# EAGLE design MicroBlue-CPU+PSU_1.0_rdob-millable (EAGLE 6.6.0)
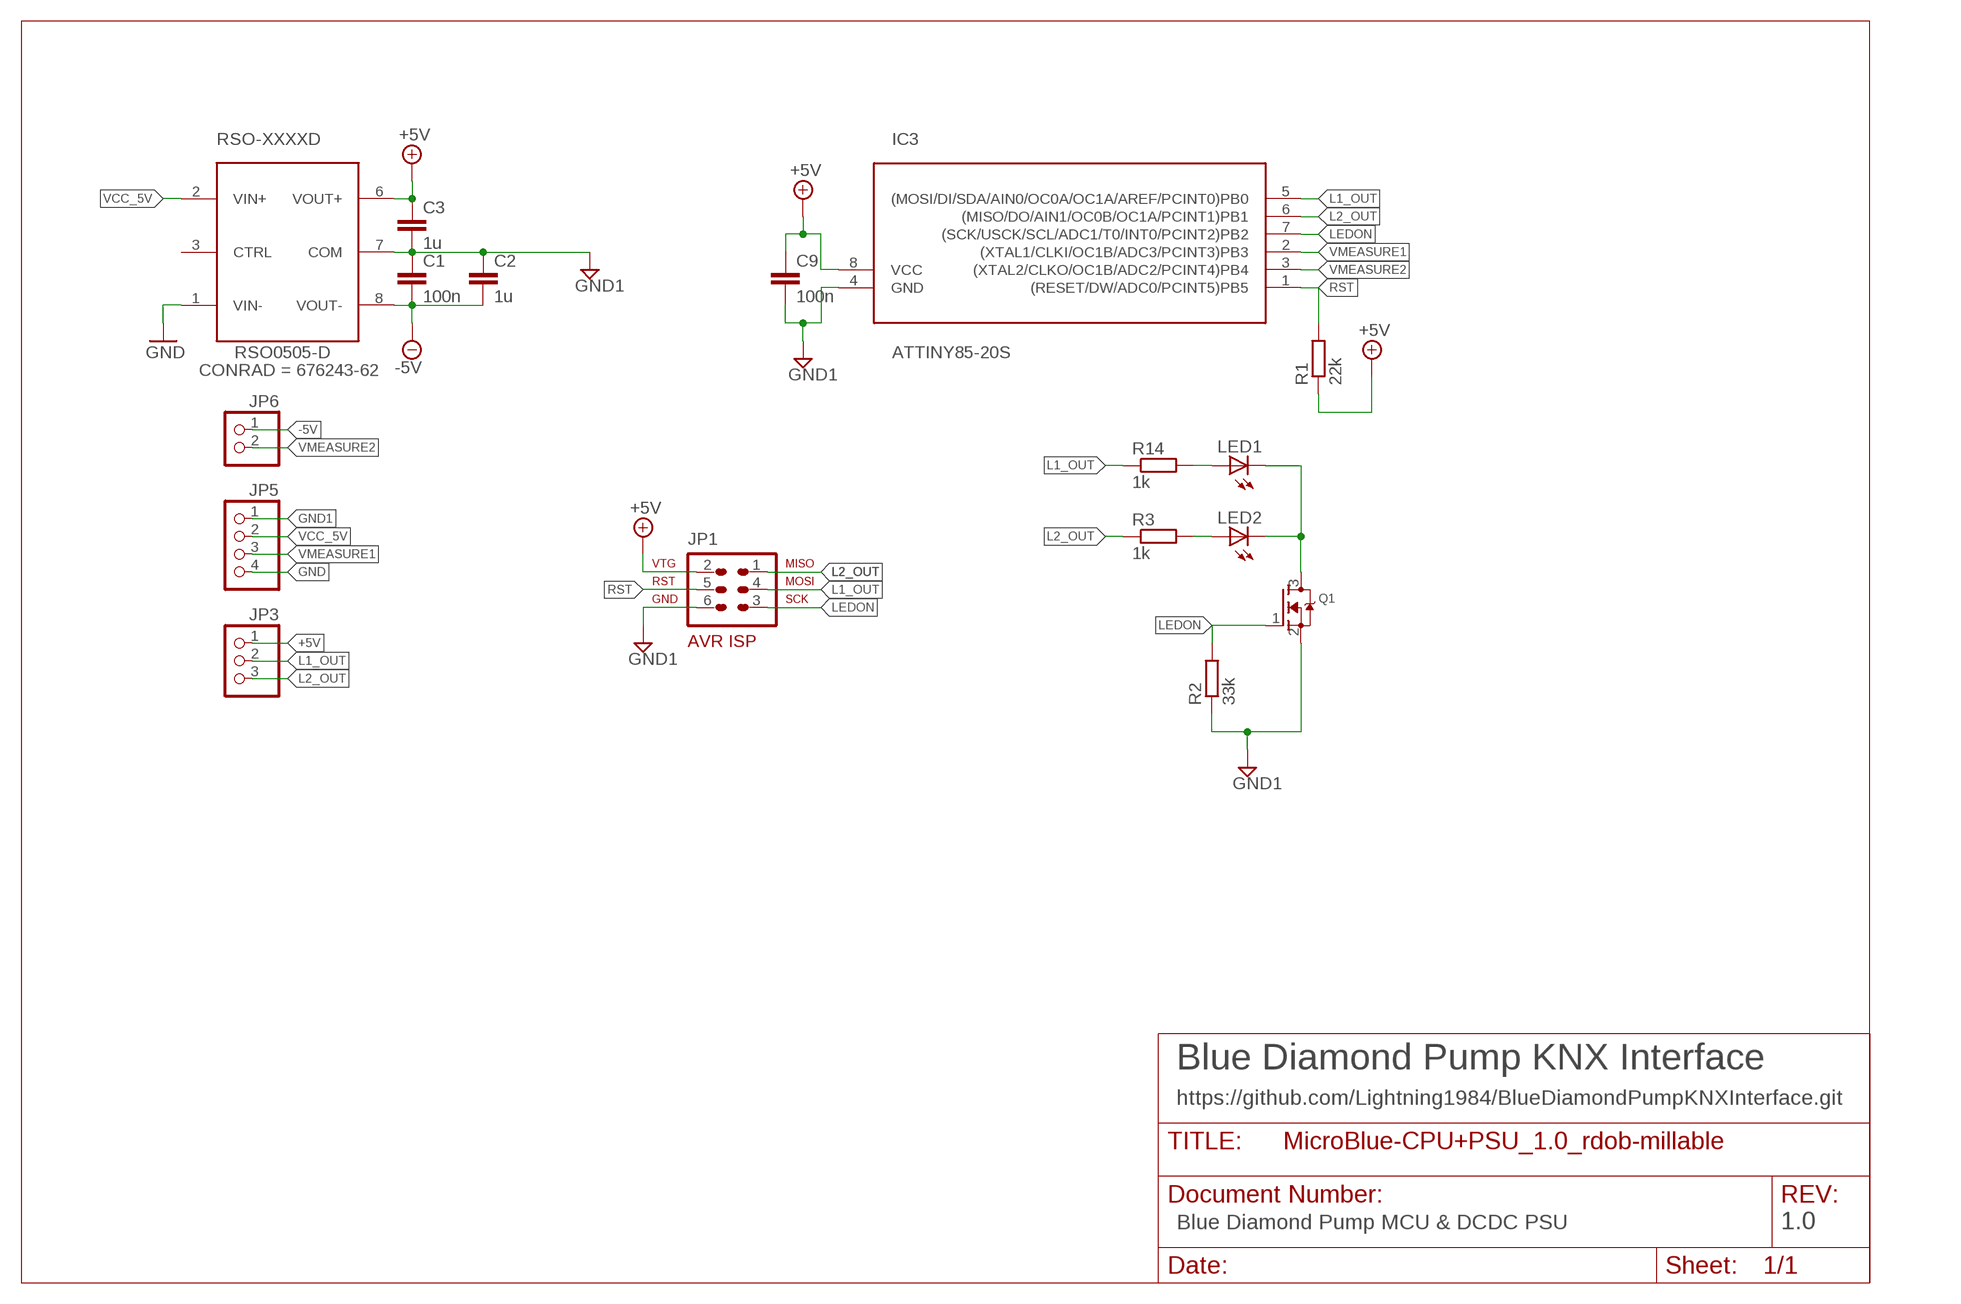
[diagram p0: schematic, sheet 1]

## Parts
C1  100n  C-EUC0805K  [C0805K]
C2  1u  C-EUC0805K  [C0805K]
C3  1u  C-EUC0805K  [C0805K]
C9  100n  C-EUC0805K  [C0805K]
IC3  ATTINY85-20S  [SOIC8]
JP1  AVR-ISP-6R  [AVR-ISP-6R]
JP3  PINHD-1X03_2.54-0.90MM-DRILL  [1X03-0.90DRILL]
JP5  PINHD-1X04_2.54-0.90MM-DRILL  [1X04-0.90DRILL]
JP6  PINHD-1X02_2.54-0.90MM-DRILL  [1X02-0.90DRILL]
LED1  LEDSMT1206  [1206]
LED2  LEDSMT1206  [1206]
Q1  MOSFET-NREFLOW  [SOT23]
R1  22k  R-EU_R1206  [R1206]
R2  33k  R-EU_R1206  [R1206]
R3  1k  R-EU_R1206  [R1206]
R14  1k  R-EU_R1206  [R1206]
RSO0505-D  RSO-0505D  RSO-XXXXD_RSO-XXXXD  [RSO-XXXX]

## Nets
+5V: C3.1 C9.1 IC3.8(VCC) JP1.2 JP3.1 R1.1 RSO0505-D.6(VOUT+)
-5V: C1.2 C2.2 JP6.1 RSO0505-D.8(VOUT-)
GND: JP5.4 RSO0505-D.1(VIN-)
GND1: C1.1 C2.1 C3.2 C9.2 IC3.4(GND) JP1.6 JP5.1 Q1.2(S) R2.1 RSO0505-D.7(COM)
L1_OUT: IC3.5((MOSI/DI/SDA/AIN0/OC0A/OC1A/AREF/PCINT0)PB0) JP1.4 JP3.2 R14.1
L2_OUT: IC3.6((MISO/DO/AIN1/OC0B/OC1A/PCINT1)PB1) JP1.1 JP3.3 R3.1
LEDON: IC3.7((SCK/USCK/SCL/ADC1/T0/INT0/PCINT2)PB2) JP1.3 Q1.1(G) R2.2
N$3: LED2.A R3.2
N$9: LED1.A R14.2
PROG: LED1.C LED2.C Q1.3(D)
RST: IC3.1((RESET/DW/ADC0/PCINT5)PB5) JP1.5 R1.2
VCC_5V: JP5.2 RSO0505-D.2(VIN+)
VMEASURE1 [ANALOG]: IC3.2((XTAL1/CLKI/OC1B/ADC3/PCINT3)PB3) JP5.3
VMEASURE2 [ANALOG]: IC3.3((XTAL2/CLKO/OC1B/ADC2/PCINT4)PB4) JP6.2
Unconnected: RSO0505-D.3(CTRL)

## Notes on the sheet
- Blue Diamond Pump KNX Interface
- https://github.com/Lightning1984/BlueDiamondPumpKNXInterface.git
- Blue Diamond Pump MCU & DCDC PSU | 1.0

## Library data of the parts
C1-C3 C9 = rcl:C-EU: CAPACITOR, European symbol
IC3 = avr:ATTINY85: MICROCONTROLLER 8 Kbytes FLASH 512 bytes EEPROM 512 bytes RAM 4-channel 10 bit ADC USI
JP1 = atmel:AVR-ISP-6: AVR ISP-6 Serial Programming Header
JP3 = pinhead-2:PINHD-1X03: PIN HEADER
JP5 = pinhead-2:PINHD-1X04: PIN HEADER
JP6 = pinhead-2:PINHD-1X02: PIN HEADER
LED1 LED2 = led:LED: LED OSRAM: - CHIPLED LG R971, LG N971, LY N971, LG Q971, LY Q971, LO R971, LY R971 LH N974, LH R974 LS Q976, LO Q976, LY Q976 LO Q996 - Hyper CHIPLED LW Q18S LB Q993, LB Q99A, LB R99A - SideLED LS A670, LO A670, LY A670, LG A670, LP A670 LB A673, LV A673, LT A673, LW A673 LH A674 LY A675 LS A676, LA A676, LO A676, LY A676, LW A676 LS A679, LY A679, LG A679 - Hyper Micro SIDELED® LS Y876, LA Y876, LO Y876, LY Y876 LT Y87S - SmartLED LW L88C, LW L88S LB L89C, LB L89S, LG L890 LS L89K, LO L89K, LY L89K LS L896, LA L896, LO L896, LY L896 - TOPLED LS T670, LO T670, LY T670, LG T670, LP T670 LSG T670, LSP T670, LSY T670, LOP T670, LYG T670 LG T671, LOG T671, LSG T671 LB T673, LV T673, LT T673, LW T673 LH T674 LS T676, LA T676, LO T676, LY T676, LB T676, LH T676, LSB T676, LW T676 LB T67C, LV T67C, LT T67C, LS T67K, LO T67K, LY T67K, LW E67C LS E67B, LA E67B, LO E67B, LY E67B, LB E67C, LV E67C, LT E67C LW T67C LS T679, LY T679, LG T679 LS T770, LO T770, LY T770, LG T770, LP T770 LB T773, LV T773, LT T773, LW T773 LH T774 LS E675, LA E675, LY E675, LS T675 LS T776, LA T776, LO T776, LY T776, LB T776 LHGB T686 LT T68C, LB T68C - Hyper Mini TOPLED® LB M676 - Mini TOPLED Santana® LG M470 LS M47K, LO M47K, LY M47K Source: http://www.osram.convergy.de LUXEON: - LUMILED® LXK2-PW12-R00, LXK2-PW12-S00, LXK2-PW14-U00, LXK2-PW14-V00 LXK2-PM12-R00, LXK2-PM12-S00, LXK2-PM14-U00 LXK2-PE12-Q00, LXK2-PE12-R00, LXK2-PE12-S00, LXK2-PE14-T00, LXK2-PE14-U00 LXK2-PB12-K00, LXK2-PB12-L00, LXK2-PB12-M00, LXK2-PB14-N00, LXK2-PB14-P00, LXK2-PB14-Q00 LXK2-PR12-L00, LXK2-PR12-M00, LXK2-PR14-Q00, LXK2-PR14-R00 LXK2-PD12-Q00, LXK2-PD12-R00, LXK2-PD12-S00 LXK2-PH12-R00, LXK2-PH12-S00 LXK2-PL12-P00, LXK2-PL12-Q00, LXK2-PL12-R00 Source: www.luxeon.com KINGBRIGHT: KA-3528ASYC Source: www.kingbright.com
Q1 = adafruit-2:MOSFET-N: N-Channel Mosfet 2N7002E - 60V 260mA SOT23 [Digikey: 2N7002ET1GOSTR-ND] - REEL BSH103 - 30V 850mA SOT23 [Digikey: 568-5013-1-ND]
R1-R3 R14 = rcl:R-EU_: RESISTOR, European symbol
RSO0505-D = rdob-devices:RSO-XXXXD; CONRAD: 676243-62; DEVICE: RSO0505-D

## Net classes
1 ANALOG: clearance 0.4 mm to class 0, clearance 0.4 mm

## Board
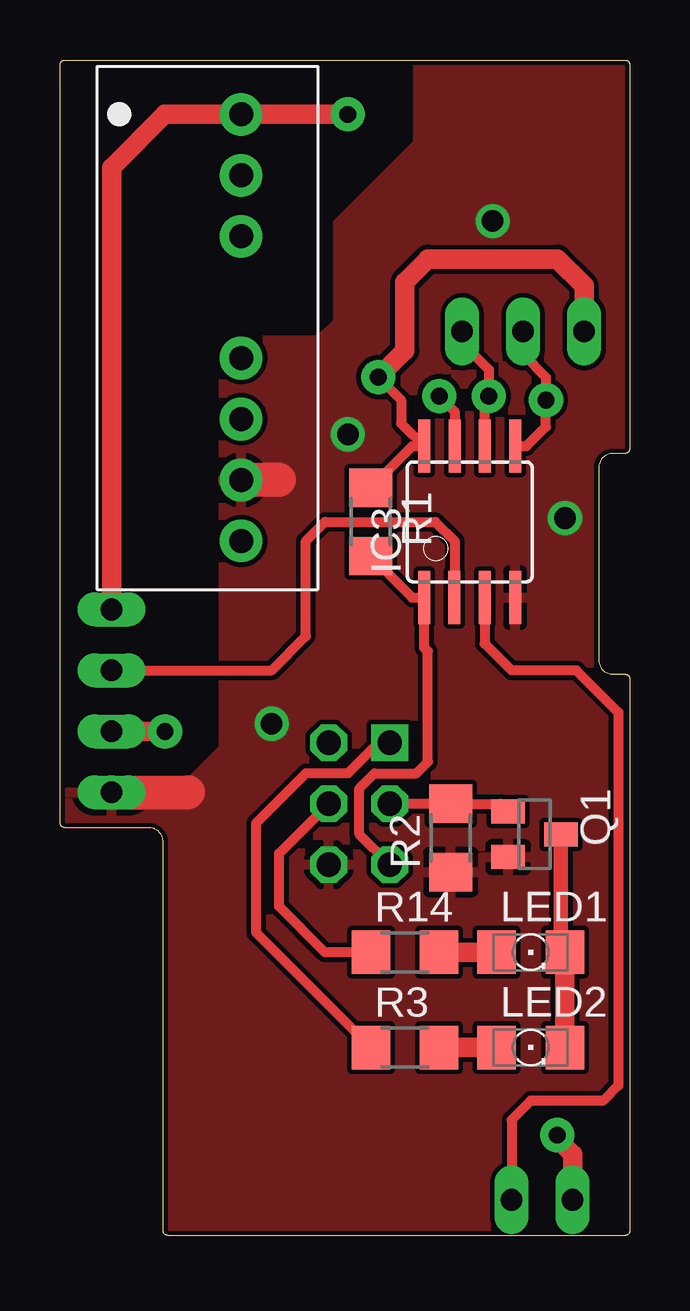
[diagram p1: board, top side]
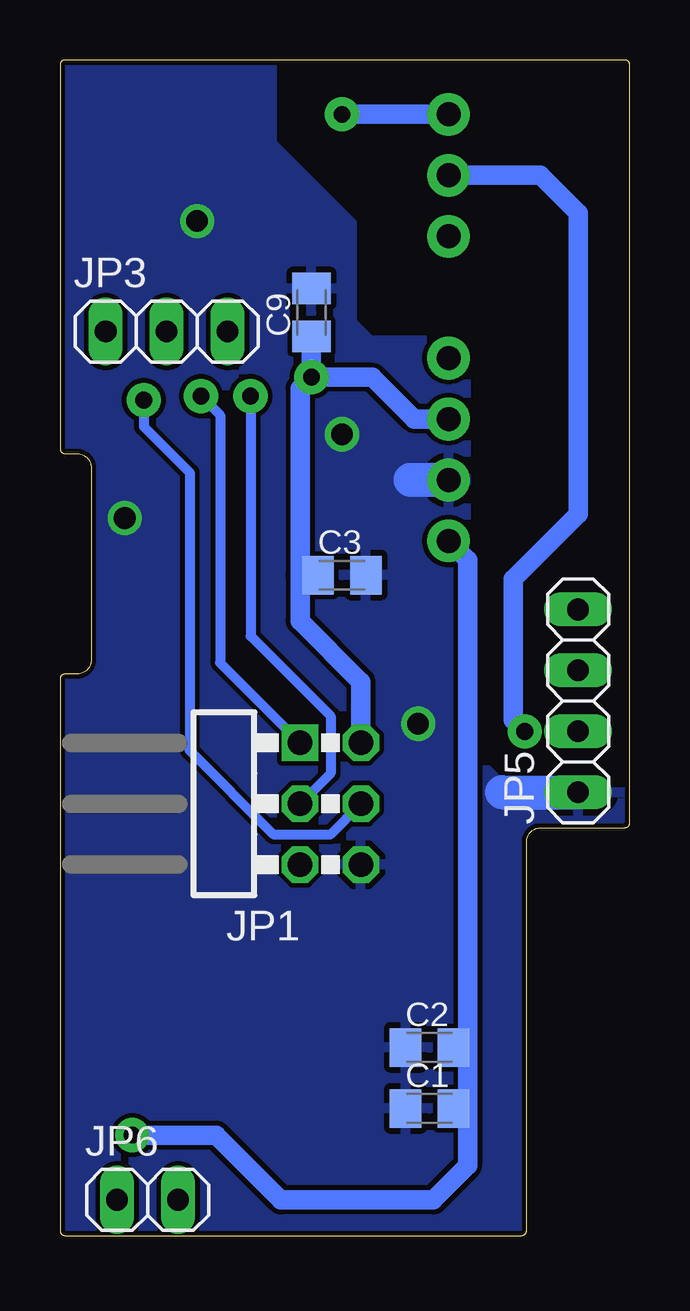
[diagram p2: board, bottom side, seen from below]

Size 23.74 x 49 mm. Coordinates in mm from the lower left corner, seen from the top.
Outline: 3.7,17 0.2,17 arc-90 0,17.2 0,48.8 arc-90 0.2,49 23.54,49 arc-90 23.74,48.8 23.74,32.8 arc-90 23.54,32.6 23.04,32.6 arc90 22.44,32 22.44,24 arc90 23.04,23.4 23.54,23.4 arc-90 23.74,23.2 23.74,0.2 arc-90 23.54,0 4.5,0 arc-90 4.3,0.2 4.3,16.4 arc90 3.7,17
Copper layers (1*16): Top 0.035mm / dielectric 1.5mm / Bottom 0.035mm
Design rules "default *": minimum track width 12mil, minimum drill 24mil, track to track 0.2mm, track to pad 0.2mm, pad to pad 0.2mm, via to via 0.2mm, smd to smd 0.2mm, copper to edge 0.2mm, drill to drill 0.2mm, minimum pad ring 10mil, minimum via ring 8mil, stop-mask expansion 4mil, vias tented up to drill 0mil, thermal gap 10mil
tRestrict: area -0.1,19 to 14.7,49.1
bRestrict: area -0.1,19 to 14.7,49.1

### Footprints (pad centres in the part's own frame; a part is rotated, then mirrored left to right if it is on the bottom)
C0805K = smd 1.3 x 1.6: 1 -1,0; 2 1,0
SOIC8 = smd 0.5 x 2.2: 1 -1.905,-3.154; 2 -0.645,-3.154; 3 0.625,-3.154; 4 1.895,-3.154; 5 1.905,3.154; 6 0.635,3.154; 7 -0.635,3.154; 8 -1.905,3.154
AVR-ISP-6R = drill 1.016 square: 1 -2.54,-1.27 | drill 1.016 octagon: 2 -2.54,1.27; 3 0,-1.27; 4 0,1.27; 5 2.54,-1.27; 6 2.54,1.27
1X03-0.90DRILL = drill 0.9 pad 1.422 long: 1 -2.54,0; 2 0,0; 3 2.54,0
1X04-0.90DRILL = drill 0.9 pad 1.422 long: 1 -3.81,0; 2 -1.27,0; 3 1.27,0; 4 3.81,0
1X02-0.90DRILL = drill 0.9 pad 1.422 long: 1 -1.27,0; 2 1.27,0
1206 = smd 1.6 x 1.803: A -1.422,0; C 1.422,0
SOT23 = smd 1 x 1.4: 1 -0.95,-1.1; 2 0.95,-1.1; 3 0,1.1
R1206 = smd 1.6 x 1.803: 1 -1.422,0; 2 1.422,0
RSO-XXXX = drill 1 pad 1.778: 1 -7.62,0; 2 -5.08,0; 3 -2.54,0; 5 2.54,0; 6 5.08,0; 7 7.62,0; 8 10.16,0

### Placement (x,y rotation side)
C1  8.34,5.3 0 bottom
C2  8.34,7.84 0 bottom
C3  11.99,27.52 0 bottom
C9  13.26,38.48 90 bottom
IC3  17.07,29.75 0 top
JP1  12.47,18 270 bottom
JP3  19.3,37.68 0 bottom
JP5  2.15,22.29 90 bottom
JP6  20.09,1.49 0 bottom
LED1  19.61,11.81 0 top
LED2  19.61,7.84 0 top
Q1  19.77,16.73 270 top
R1  12.95,29.75 270 top
R2  16.28,16.57 90 top
R3  14.37,7.84 0 top
R14  14.37,11.81 0 top
RSO0505-D  7.55,39.11 270 top

### Tracks (layer width: path | path; a pad name or v marks a point on that pad's centre or on a via)
+5V  (via drill 0.7 pad 1.42)
  Top 0.406: R1.1 14.68,32.9 IC3.8 14.21,33.85 14.21,34.83 v13.26,35.78
  Top 0.813: v13.26,35.78 14.37,36.89 14.37,39.75 15.33,40.7 20.72,40.7 21.84,39.59 JP3.1
  Bottom 0.813: JP1.2 11.2,23.08 13.74,25.62 13.74,27.52 | C9.1 v13.26,35.78 | v13.26,35.78 13.74,35.3 13.74,27.52 | RSO0505-D.6 8.98,34.03 10.72,35.78 v13.26,35.78 | C3.1 13.74,27.52
-5V  (via drill 0.7 pad 1.42)
  Top 0.813: v20.72,4.19 20.56,4.19 21.36,3.39 JP6.1
  Bottom 0.406: C1.2 6.75,5.3 | C2.2 6.75,7.84
  Bottom 0.813: RSO0505-D.8 6.75,28.16 6.75,7.84 6.75,5.3 6.75,2.92 8.18,1.49 14.53,1.49 17.23,4.19 v20.72,4.19
GND  (via drill 0.7 pad 1.42)
  Top 0.813: JP5.4 2.15,44.51 4.37,46.73 RSO0505-D.1 v11.99,46.73
  Bottom 0.813: v11.99,46.73 RSO0505-D.1 7.39,46.73
GND1  (via drill 0.9 pad 1.42)
  Top 1.422: 9.13,31.49 RSO0505-D.7 | JP5.1 5.33,18.48
  Bottom 1.422: RSO0505-D.7 9.13,31.49 | 5.33,18.48 JP5.1
  other vias: 8.82,21.33 11.99,33.4 18.02,42.29 21.04,29.91
  pour Top: -0.23,18.95 5.17,18.95 6.59,20.38 6.59,36.89 7.23,37.52 10.72,37.52 11.36,38.16 11.36,42.29 14.69,45.62 14.69,49.11 14.85,49.27 23.58,49.27 24.06,48.8 24.06,0.06 23.74,-0.26 4.37,-0.26 -0.23,4.35
  pour Bottom: -0.23,18.95 5.17,18.95 6.59,20.38 6.59,36.89 7.23,37.52 10.72,37.52 11.36,38.16 11.36,42.29 14.69,45.62 14.69,49.11 14.85,49.27 23.58,49.27 24.06,48.8 24.06,0.06 23.74,-0.26 4.37,-0.26 -0.23,4.35
L1_OUT  (via drill 0.7 pad 1.42)
  Top 0.406: JP3.2 19.3,36.73 20.25,35.78 v20.25,34.83 20.25,33.72 19.43,32.9 IC3.5 | R14.1 11.04,11.81 9.13,13.71 9.13,15.94 JP1.4
  Bottom 0.406: v20.25,34.83 20.25,33.72 18.34,31.81 18.34,20.22 14.85,16.73 12.47,16.73 JP1.4
L2_OUT  (via drill 0.7 pad 1.42)
  Top 0.406: JP3.3 16.76,37.21 17.87,36.1 v17.87,34.98 17.71,34.83 IC3.6 | JP1.1 13.26,20.54 11.99,19.27 10.25,19.27 8.18,17.2 8.18,12.61 R3.1
  Bottom 0.406: v17.87,34.98 17.07,34.19 17.07,23.87 JP1.1
LEDON  (via drill 0.7 pad 1.42)
  Top 0.406: JP1.3 R2.2 18.36,17.99 Q1.1 | v15.8,34.98 16.44,34.35 IC3.7
  Bottom 0.406: v15.8,34.98 15.8,24.98 12.47,21.65 12.47,19.27 JP1.3
N$3
  Top 0.813: R3.2 LED2.A
N$9
  Top 0.813: R14.2 LED1.A
PROG
  Top 0.406: 20.87,11.65 21.04,11.65 21.04,11.81 | 21.04,11.97 21.04,11.81 | 21.04,11.81 21.2,11.81 21.2,11.65 | 21.04,11.81 LED1.C
  Top 0.61: Q1.3 20.87,11.97 LED1.C
  Top 0.813: LED1.C LED2.C
RST
  Top 0.406: R1.2 14.68,26.59 IC3.1 15.17,24.51 15.33,24.35 15.33,19.74 14.85,19.27 13.1,19.27 12.47,18.63 12.47,16.73 JP1.5
VCC_5V  (via drill 0.7 pad 1.42)
  Top 0.813: JP5.2 v4.37,21.02
  Bottom 0.813: v4.37,21.02 4.85,21.49 4.85,27.36 2.15,30.06 2.15,42.61 3.74,44.19 RSO0505-D.2
VMEASURE1
  Top 0.406: JP5.3 8.82,23.55 10.25,24.98 10.25,28.95 11.04,29.75 15.64,29.75 16.44,28.95 16.44,26.6 IC3.2
VMEASURE2
  Top 0.406: IC3.3 17.7,24.68 18.82,23.55 21.52,23.55 23.26,21.81 23.26,6.25 22.63,5.62 19.61,5.62 18.82,4.82 JP6.2

### Text on the board
Document: Selfbus KNX 2in-2out Interface / for Blue Diamond MicroBlue Condensate Pump / Ver. 1.0 (c) Rupert Dobrounig / 04.11.2016 / https://github.com/Lightning1984/BlueDiamondPumpKNXInterface.git
ttext: BlueD / Pump / MCU/PSU | (c) RDOB / v.1.0 / 04.11.2016